# EAGLE design main_board (EAGLE 5.10)
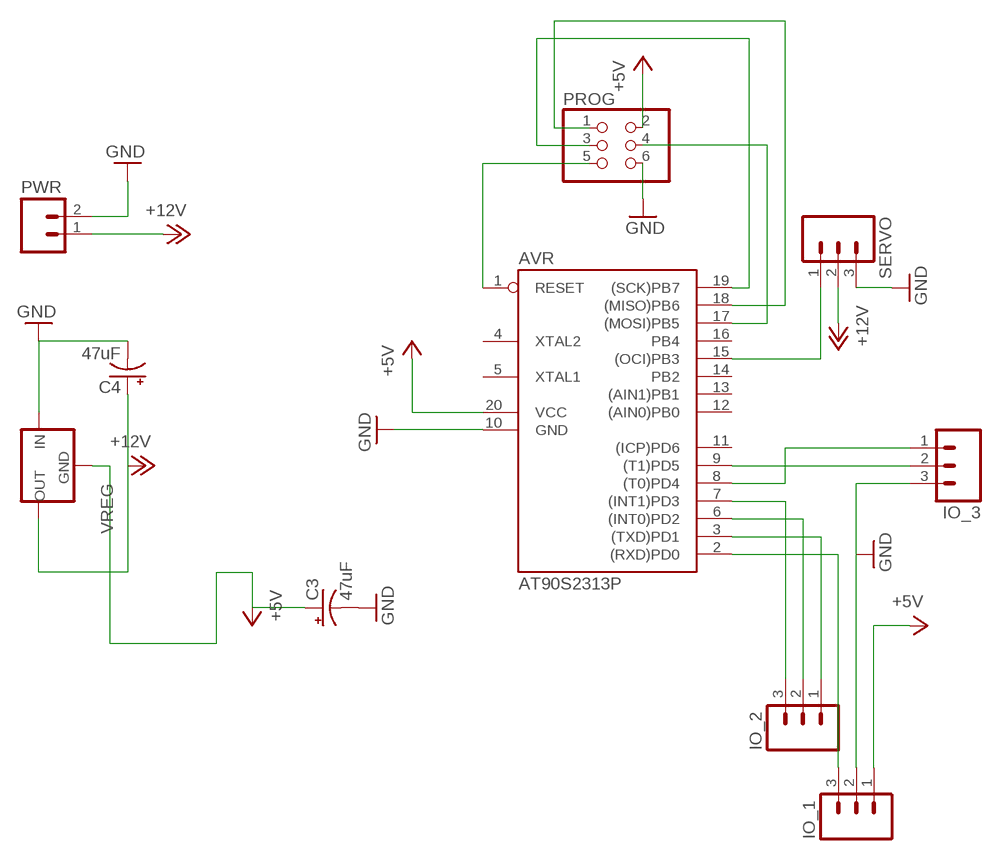
[diagram p0: schematic, sheet 1]

## Parts
AVR  AT90S2313P  [DIL20]
C3  47uF  CPOL-USE2.5-7  [E2,5-7]
C4  47uF  CPOL-USE2.5-7  [E2,5-7]
IO_1  M03SCREW  [SCREWTERMINAL-3.5MM-3]
IO_2  M03SCREW  [SCREWTERMINAL-3.5MM-3]
IO_3  M03SCREW  [SCREWTERMINAL-3.5MM-3]
PROG  PINHD-2X3  [2X03]
PWR  M023.5MM_LOCK  [SCREWTERMINAL-3.5MM-2_LOCK]
SERVO  M03LOCK  [1X03_LOCK]
VREG  79LXX  [79LXX]

## Nets
+5V: AVR.20(VCC) C3.+ IO_1.1 PROG.2 VREG.GND
+12V: C4.+ PWR.1 SERVO.2 VREG.OUT
GND: AVR.10(GND) C3.- C4.- IO_1.2 IO_3.3 PROG.6 PWR.2 SERVO.3 VREG.IN
N$1: AVR.15((OCI)PB3) SERVO.1
N$2: AVR.17((MOSI)PB5) PROG.4
N$3: AVR.1(RESET) PROG.5
N$4: AVR.18((MISO)PB6) PROG.1
N$5: AVR.9((T1)PD5) IO_3.2
N$6: AVR.8((T0)PD4) IO_3.1
N$7: AVR.7((INT1)PD3) IO_2.3
N$8: AVR.6((INT0)PD2) IO_2.2
N$9: AVR.3((TXD)PD1) IO_2.1
N$10: AVR.2((RXD)PD0) IO_1.3
N$14: AVR.19((SCK)PB7) PROG.3
Unconnected: AVR.4(XTAL2) AVR.5(XTAL1) AVR.11((ICP)PD6) AVR.12((AIN0)PB0) AVR.13((AIN1)PB1) AVR.14(PB2) AVR.16(PB4)

## Library data of the parts
AVR = atmel:AT90S2313: MICROCONTROLLER 2 Kbytes FLASH 128 bytes SRAM 128 bytes EEPROM UART
C3 C4 = rcl:CPOL-US: POLARIZED CAPACITOR, American symbol
IO_1-IO_3 SERVO = SparkFun:M03: Header 3 Standard 3-pin 0.1" header. Use with straight break away headers (SKU : PRT-00116), right angle break away headers (PRT-00553), swiss pins (PRT-00743), machine pins (PRT-00117), and female headers (PRT-00115). Molex polarized connector foot print use with SKU : PRT-08232 with associated crimp pins and housings.
PROG = pinhead:PINHD-2X3: PIN HEADER
PWR = SparkFun:M02: Header 2 Standard 2-pin 0.1" header. Use with straight break away headers (SKU : PRT-00116), right angle break away headers (PRT-00553), swiss pins (PRT-00743), machine pins (PRT-00117), and female headers (PRT-00115). Molex polarized connector foot print use with SKU : PRT-08233 with associated crimp pins and housings.
VREG = v-reg:79LXX: VOLTAGE REGULATOR

## Board
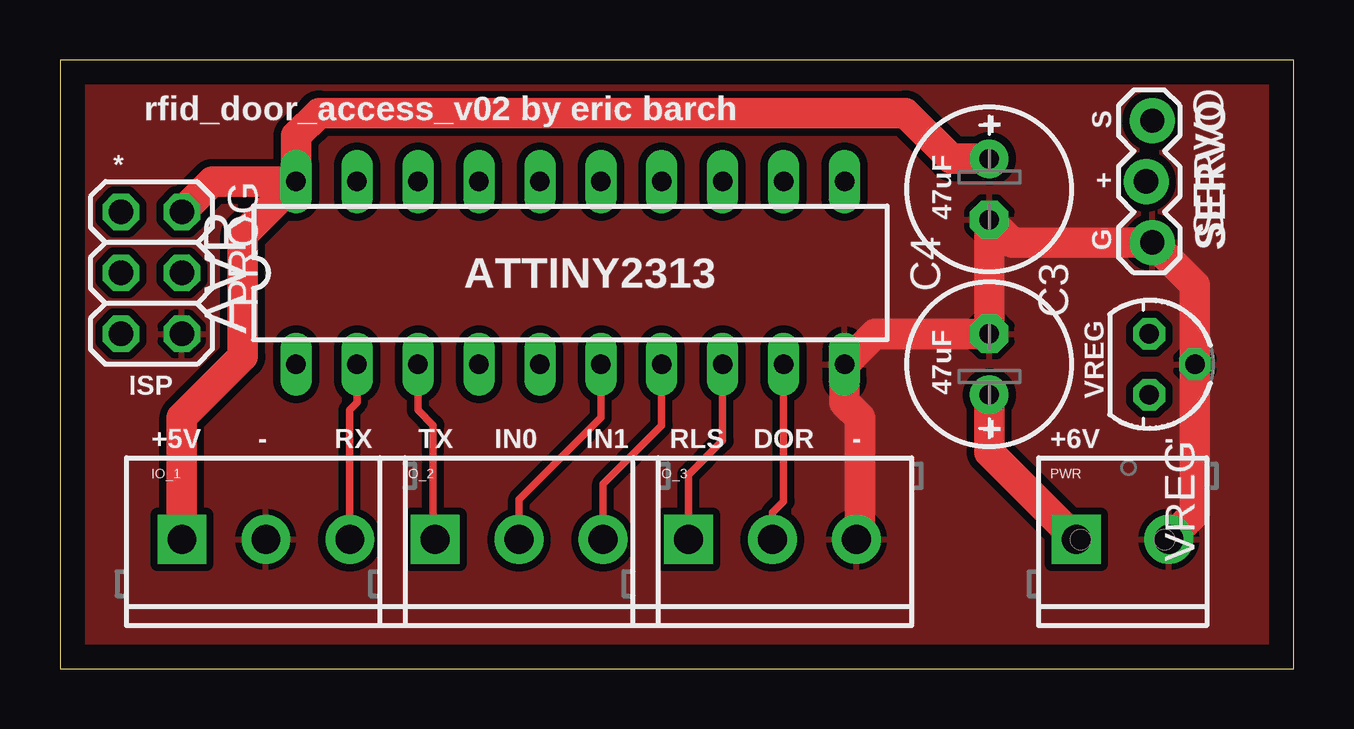
[diagram p1: board, top side]
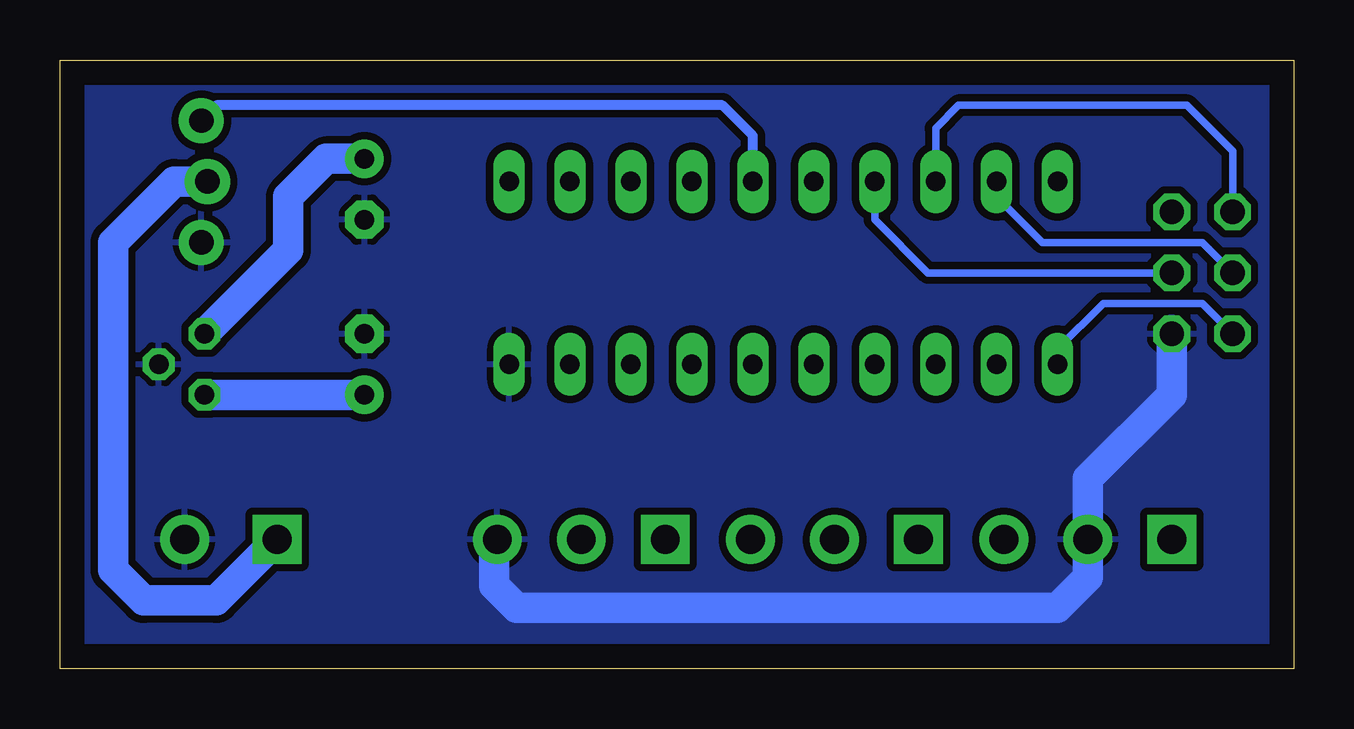
[diagram p2: board, bottom side, seen from below]

Size 51.42 x 25.39 mm. Coordinates in mm from the lower left corner, seen from the top.
Outline: 0,0 51.42,0 51.42,25.39 0,25.39 0,0
Copper layers (1*16): Top 0.035mm / dielectric 1.5mm / Bottom 0.035mm
Design rules "default": minimum track width 10mil, minimum drill 24mil, track to track 8mil, track to pad 8mil, pad to pad 8mil, via to via 8mil, smd to smd 8mil, copper to edge 40mil, drill to drill 8mil, minimum pad ring 10mil, minimum via ring 8mil, stop-mask expansion 4mil, vias tented up to drill 0mil, thermal gap 10mil

### Footprints (pad centres in the part's own frame; a part is rotated, then mirrored left to right if it is on the bottom)
DIL20 = drill 0.813 long: 1 -11.43,-3.81; 2 -8.89,-3.81; 3 -6.35,-3.81; 4 -3.81,-3.81; 5 -1.27,-3.81; 6 1.27,-3.81; 7 3.81,-3.81; 8 6.35,-3.81; 9 8.89,-3.81; 10 11.43,-3.81; 11 11.43,3.81; 12 8.89,3.81; 13 6.35,3.81; 14 3.81,3.81; 15 1.27,3.81; 16 -1.27,3.81; 17 -3.81,3.81; 18 -6.35,3.81; 19 -8.89,3.81; 20 -11.43,3.81
E2,5-7 = drill 0.813 pad 1.6 round: + -1.27,0 | drill 0.813 pad 1.6 octagon: - 1.27,0
SCREWTERMINAL-3.5MM-3 = drill 1.2 pad 2.032 square: 1 0,0 | drill 1.2 pad 2.032 round: 2 3.5,0; 3 7,0
2X03 = drill 1.016 octagon: 1 -2.54,-1.27; 2 -2.54,1.27; 3 0,-1.27; 4 0,1.27; 5 2.54,-1.27; 6 2.54,1.27
SCREWTERMINAL-3.5MM-2_LOCK = drill 1.2 pad 2.032 square: 1 -0.178,0 | drill 1.2 pad 2.032 round: 2 3.678,0
1X03_LOCK = drill 1.016 pad 1.88 round: 1 0,0.127; 2 2.54,-0.127; 3 5.08,0.127
79LXX = drill 0.813 octagon: GND -1.27,0; IN 0,1.905; OUT 1.27,0

### Placement (x,y rotation side)
AVR  21.27,16.51 0 top
C3  38.73,20 270 top
C4  38.73,12.7 90 top
IO_1  5.08,5.4 0 top
IO_2  15.64,5.4 0 top
IO_3  26.19,5.4 0 top
PROG  3.81,16.51 270 top
PWR  42.55,5.4 0 top
SERVO  45.4,22.86 270 top
VREG  45.4,12.7 270 top

### Tracks (layer width: path | path; a pad name or v marks a point on that pad's centre or on a via)
+5V
  Top 1.27: C3.+ 37.15,21.27 35.24,23.18 10.79,23.18 9.84,22.23 AVR.20 | AVR.20 6.35,20.32 PROG.2 | IO_1.1 5.08,10.48 7.62,13.02 7.62,18.1 AVR.20
  Bottom 1.27: C3.+ 40.32,21.27 41.91,19.68 41.91,17.46 VREG.GND
+12V
  Top 1.27: C4.+ 38.73,9.03 PWR.1
  Bottom 1.27: C4.+ VREG.OUT | SERVO.2 46.67,20.32 49.21,17.78 49.21,4.13 47.94,2.86 44.91,2.86 PWR.1
GND
  Top 1.27: PWR.2 47.31,6.48 VREG.IN 47.31,16 SERVO.3 39.69,17.78 C3.- C4.- 33.97,13.97 AVR.10 32.7,11.11 33.34,10.48 33.34,5.54 IO_3.3
  Bottom 1.27: PROG.6 5.08,11.43 8.57,7.94 IO_1.2 | IO_1.2 | IO_1.2 8.57,3.81 9.84,2.54 32.38,2.54 33.34,3.49 33.34,5.25 IO_3.3
  pour Bottom (isolate 0.305): 0,25.4 51.44,25.4 51.44,0 0,0
  pour Top (isolate 0.305): 0,25.4 51.44,25.4 51.44,0 0,0
N$1
  Bottom 0.406: AVR.15 22.54,22.23 23.81,23.5 44.9,23.5 SERVO.1
N$2
  Bottom 0.305: PROG.4 15.24,16.51 17.46,18.73 AVR.17
N$3
  Bottom 0.305: PROG.5 3.81,15.24 7.94,15.24 9.84,13.34 AVR.1
N$4
  Bottom 0.305: AVR.18 14.92,22.54 13.97,23.5 4.45,23.5 2.54,21.59 PROG.1
N$5
  Top 0.305: IO_3.2 29.69,6.52 30.16,6.99 AVR.9
N$6
  Top 0.305: IO_3.1 26.19,8.1 27.62,9.53 AVR.8
N$7
  Top 0.305: IO_2.3 22.64,7.71 25.08,10.16 AVR.7
N$8
  Top 0.305: IO_2.2 19.14,7.07 22.54,10.48 AVR.6
N$9
  Top 0.305: AVR.3 14.92,10.79 15.56,10.16 15.56,5.48 IO_2.1
N$10
  Top 0.305: AVR.2 12.38,11.11 12.06,10.79 12.06,5.41 IO_1.3
N$14
  Bottom 0.305: PROG.3 3.81,17.78 10.48,17.78 12.38,19.68 AVR.19

### Text on the board
_tsilk: rfid_door_access_v02 by eric barch | S | + | * | + | 47uF | G | SERVO | ATTINY2313 | ISP | 47uF | VREG | + | +5V | - | RX | TX | IN0 | IN1 | RLS | DOR | - | +6V | -